# EAGLE design nodo_AS (EAGLE 9.6.2)
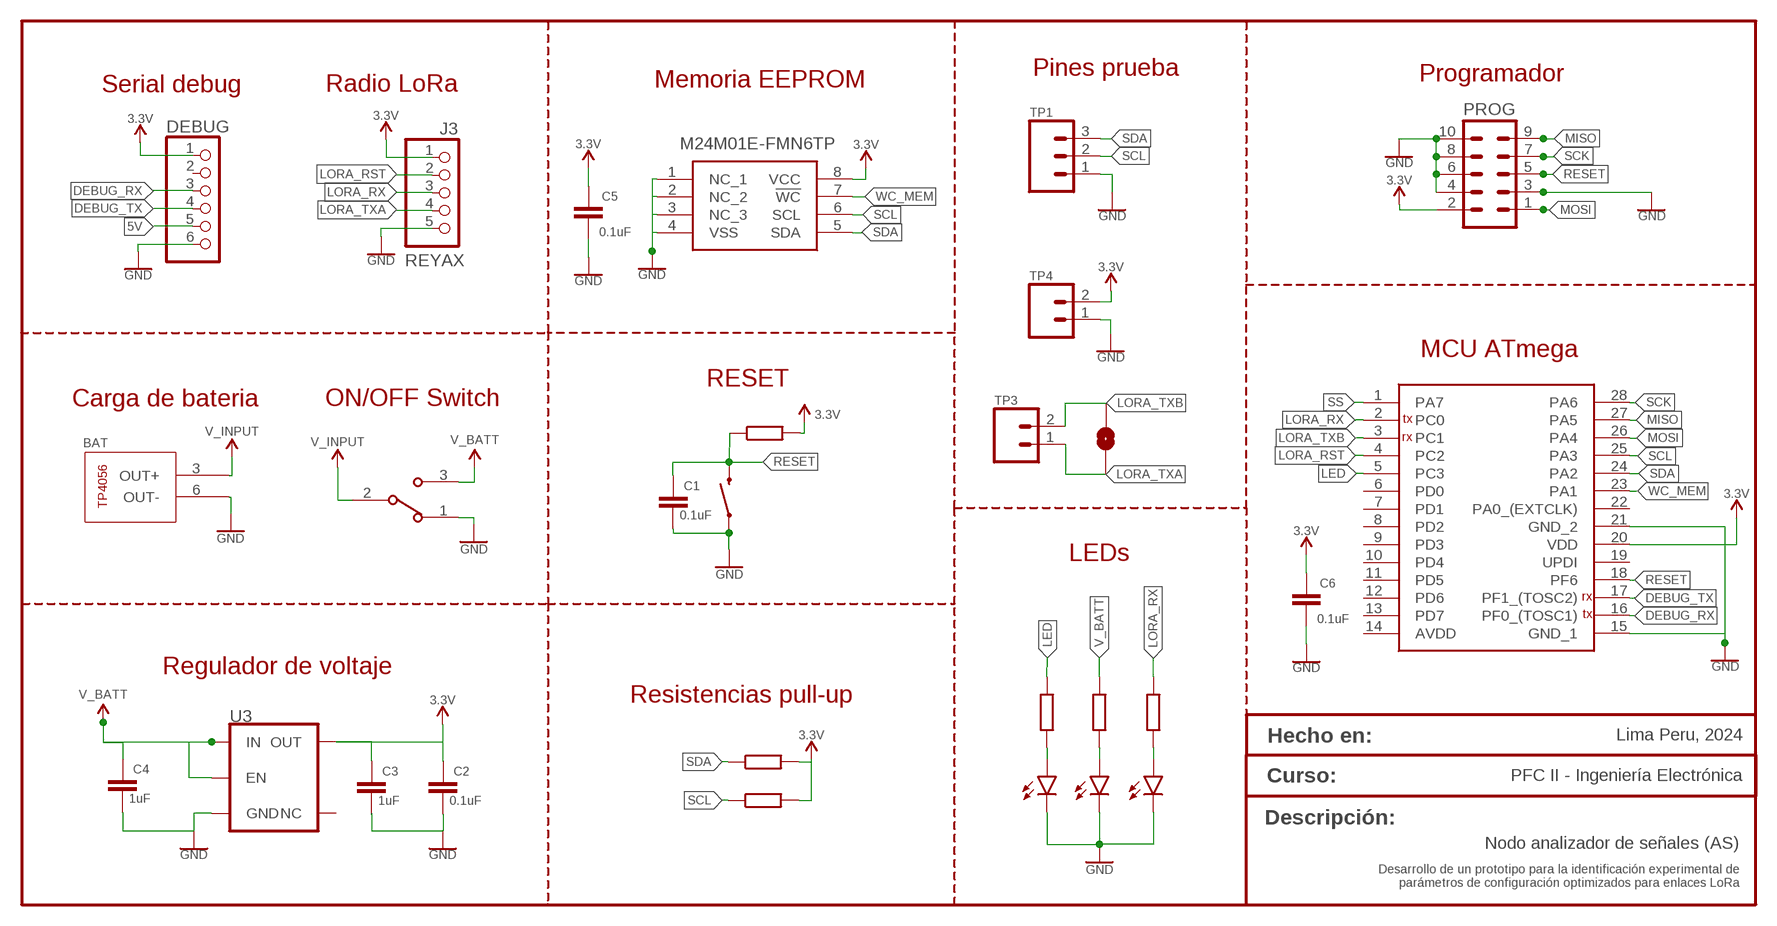
[diagram p0: schematic, sheet 1]

## Parts
BAT  TP4056MODULE  [TP4056MODULE]
C1  0.1uF  C-EUC0603K  [C0603K]
C2  0.1uF  C-EUC0603K  [C0603K]
C3  1uF  C-EUC0603K  [C0603K]
C4  1uF  C-EUC0603K  [C0603K]
C5  0.1uF  0.1UF-0603-25V-(+80/-20%)  [0603]
C6  0.1uF  0.1UF-0603-25V-(+80/-20%)  [0603]
DEBUG  PINHD-1X6  [1X06]
IC1  ATMEGA3208-XU  [SOP65P780X200-28N]
IC2  M24M01E-FMN6TP  [SOIC127P600X175-8N]
J3  REYAX  PINHD-1X5  [1X05]
JP1  JUMPER-SMT_2_NO_NO-SILK_ROUND  [SMT-JUMPER_2_NO_NO-SILK_ROUND]
L_ON  LED_3MM  [LEDRD254W50D405H1055]
L_ON1  LED_3MM  [LEDRD254W50D405H1055]
L_ON2  LED_3MM  [LEDRD254W50D405H1055]
P_RESET  MOMENTARY-SWITCH-SPST-PTH-6.0MM  [TACTILE_SWITCH_PTH_6.0MM]
PROG  ML10-3M  [3M_10]
R1  68  R-EU_0207/10  [0207/10]
R2  68  R-EU_0207/10  [0207/10]
R3  68  R-EU_0207/10  [0207/10]
R4  10k  R-EU_0207/10  [0207/10]
R6  1k  R-EU_0207/10  [0207/10]
R7  1k  R-EU_0207/10  [0207/10]
SW1  EG1213  [SW_EG1213]
TP1  CONN_03  [1X03]
TP3  CONN_02  [1X02]
TP4  CONN_02  [1X02]
U3  3.3V  V_REG_AP2112K-3.3V  [SOT23-5]

## Nets
3.3V: C2.1 C3.1 C5.1 C6.1 DEBUG.1 IC1.20(VDD) IC2.8(VCC) J3.1 PROG.2 R4.2 R6.2 R7.2 TP4.2 U3.5(OUT)
5V: DEBUG.5
DEBUG_RX: DEBUG.3 IC1.16(PF0_(TOSC1))
DEBUG_TX: DEBUG.4 IC1.17(PF1_(TOSC2))
GND: BAT.6(OUT-) C1.2 C2.2 C3.2 C4.2 C5.2 C6.2 DEBUG.6 IC1.15(GND_1) IC1.21(GND_2) IC2.1(NC_1) IC2.2(NC_2) IC2.3(NC_3) IC2.4(VSS) J3.5 L_ON1.C L_ON2.C L_ON.C P_RESET.1 PROG.3 PROG.4 PROG.6 PROG.8 PROG.10 SW1.1 TP1.1 TP4.1 U3.2(GND)
LED: IC1.5(PC3) R3.1
LORA_RST: IC1.4(PC2) J3.2
LORA_RX: IC1.2(PC0) J3.3 R1.1
LORA_TXA: J3.4 JP1.2 TP3.1
LORA_TXB: IC1.3(PC1) JP1.1 TP3.2
MISO: IC1.27(PA5) PROG.9
MOSI: IC1.26(PA4) PROG.1
N$1: L_ON.A R3.2
N$2: L_ON1.A R2.2
N$3: L_ON2.A R1.2
RESET: C1.1 IC1.18(PF6) P_RESET.3 PROG.5 R4.1
SCK: IC1.28(PA6) PROG.7
SCL: IC1.25(PA3) IC2.6(SCL) R7.1 TP1.2
SDA: IC1.24(PA2) IC2.5(SDA) R6.1 TP1.3
SS: IC1.1(PA7)
V_BATT: C4.1 R2.1 SW1.3 U3.1(IN) U3.3(EN)
V_INPUT: BAT.3(OUT+) SW1.2
WC_MEM: IC1.23(PA1) IC2.7(!WC)
Unconnected: DEBUG.2 IC1.6(PD0) IC1.7(PD1) IC1.8(PD2) IC1.9(PD3) IC1.10(PD4) IC1.11(PD5) IC1.12(PD6) IC1.13(PD7) IC1.14(AVDD) IC1.19(UPDI) IC1.22(PA0_(EXTCLK)) U3.4(NC)

## Notes on the sheet
- Pines prueba | Programador
- Serial debug | Radio LoRa | Memoria EEPROM
- MCU ATmega
- RESET
- Carga de bateria | ON/OFF Switch
- tx
- rx
- LEDs
- rx
- tx
- Regulador de voltaje
- Resistencias pull-up
- Hecho en: | Lima Peru, 2024
- Curso: | PFC II - Ingeniería Electrónica
- Descripción:
- Nodo analizador de señales (AS)
- Desarrollo de un prototipo para la identificación experimental de
  parámetros de configuración optimizados para enlaces LoRa

## Library data of the parts
BAT = TP4056MODULE:TP4056MODULE
C1-C4 = rcl:C-EU: CAPACITOR, European symbol; SPICEPREFIX: C
C5 C6 = SparkFun-Capacitors:0.1UF: 0.1µF ceramic capacitors A capacitor is a passive two-terminal electrical component used to store electrical energy temporarily in an electric field.; PROD_ID: CAP-00810
DEBUG = pinhead:PINHD-1X6: PIN HEADER
IC1 = ATMEGA3208-XU:ATMEGA3208-XU: 8-bit Microcontrollers - MCU 20MHz, 32KB, SSOP Source: Datasheet <https://componentsearchengine.com/Datasheets/1/ATMEGA3208-XU.pdf>; DESCRIPTION: 8-bit Microcontrollers - MCU 20MHz, 32KB, SSOP; HEIGHT: 2mm; MANUFACTURER_NAME: Microchip; MANUFACTURER_PART_NUMBER: ATMEGA3208-XU; MOUSER_PART_NUMBER: 556-ATMEGA3208-XU; MOUSER_PRICE-STOCK: https://www.mouser.co.uk/ProductDetail/Microchip-Technology/ATMEGA3208-XU?qs=P1JMDcb91o4lOyDu0%252BDLyg%3D%3D
IC2 = M24M01E-FMN6TP:M24M01E-FMN6TP: 1 Mbit Serial I2C bus EEPROM with configurable device address and software write protection registers Source: Datasheet <https://www.st.com/resource/en/datasheet/m24m01e-f.pdf>; DESCRIPTION: 1 Mbit Serial I2C bus EEPROM with configurable device address and software write protection registers; HEIGHT: 1.75mm; MANUFACTURER_NAME: STMicroelectronics; MANUFACTURER_PART_NUMBER: M24M01E-FMN6TP; MOUSER_PART_NUMBER: 511-M24M01E-FMN6TP; MOUSER_PRICE-STOCK: https://www.mouser.co.uk/ProductDetail/STMicroelectronics/M24M01E-FMN6TP?qs=1Kr7Jg1SGW8I5RljfIUeLw%3D%3D
J3 = pinhead:PINHD-1X5: PIN HEADER
JP1 = SparkFun-Jumpers:JUMPER-SMT_2_NO: Normally open jumper This jumper has two pads in close proximity to each other. Apply solder to close the connection. Round pads are easier to solder for beginners, but are a lot larger. SparkFun Product that uses the round pads: SparkFun EL Sequencer <https://www.sparkfun.com/products/12781>
L_ON L_ON1 L_ON2 = LED_3MM:LED_3MM
P_RESET = SparkFun-Switches:MOMENTARY-SWITCH-SPST: Momentary Switch (Pushbutton) - SPST Normally-open (NO) SPST momentary switches (buttons, pushbuttons). Variants PTH-12MM - 12mm square, through-hole Momentary Pushbutton Switch - 12mm Square <https://www.sparkfun.com/products/9190> (COM-09190) PTH-6.0MM, PTH-6.0MM-KIT - 6.0mm square, through-hole Mini Pushbutton Switch <https://www.sparkfun.com/products/97> (COM-00097) KIT package intended for soldering kit's - only one side of pads' copper is exposed. PTH-RIGHT-ANGLE-KIT - Right-angle, through-hole Right Angle Tactile Button <https://www.sparkfun.com/products/10791> - Used on SparkFun BigTime Watch Kit <https://www.sparkfun.com/products/11734> SMD-12MM - 12mm square, surface-mount Tactile Button - SMD (12mm) <https://www.sparkfun.com/products/12993> (COM-12993) Used on SparkFun PicoBoard <https://www.sparkfun.com/products/11888> SMD-4.5MM - 4.5mm Square Trackball Switch Used on SparkFun Blackberry Trackballer Breakout <https://www.sparkfun.com/products/13169> SMD-4.6MMX2.8MM - 4.60mm x 2.80mm, surface mount Used on SparkFun Pro Micro - RP2040 <https://www.sparkfun.com/products/17717> SMD-5.2MM, SMD-5.2-REDUNDANT - 5.2mm square, surface-mount Mini Pushbutton Switch - SMD <https://www.sparkfun.com/products/8720> (COM-08720) Used on Arduino Pro Mini <https://www.sparkfun.com/products/11114> REDUNDANT package connects both switch circuits together SMD-6.0X3.5MM - 6.0 x 3.5mm, surface mount Momentary Reset Switch SMD <https://www.sparkfun.com/products/8229> (COM-08229) SMD-6.2MM-TALL - 6.2mm square, surface mount Tactile Button - SMD (6mm) <https://www.sparkfun.com/products/12992> Used on SparkFun Digital Sandbox <https://www.sparkfun.com/products/12651> SMD-RIGHT-ANGLE - Right-angle, surface mount Used on SparkFun Block for Intel® Edison - Arduino <https://www.sparkfun.com/products/13036>; PROD_ID: SWCH-08441; SF_SKU: COM-00097
PROG = con-harting-ml:ML10: HARTING; OC_FARNELL: unknown; OC_NEWARK: unknown
R1-R4 R6 R7 = rcl:R-EU_: RESISTOR, European symbol; SPICEPREFIX: R
SW1 = EG1213:EG1213: EG Series SPDT On-On Right Angle Through Hole Slide Switch Check prices <https://pricing.snapeda.com/parts/EG1213/E-Switch/view-part?ref=eda>; AVAILABILITY: In Stock; DESCRIPTION: Slide Switch SPDT Through Hole, Right Angle; MF: E-Switch; MP: EG1213; PACKAGE: None; PRICE: None; PURCHASE-URL: https://pricing.snapeda.com/search/part/EG1213/?ref=eda
TP1 = SparkFun-Connectors:CONN_03: Multi connection point. Often used as Generic Header-pin footprint for 0.1 inch spaced/style header connections On any of the 0.1 inch spaced packages, you can populate with these: Break Away Headers - Straight <https://www.sparkfun.com/products/116> (PRT-00116) Break Away Male Headers - Right Angle <https://www.sparkfun.com/products/553> (PRT-00553) Female Headers <https://www.sparkfun.com/products/115> (PRT-00115) Break Away Headers - Machine Pin <https://www.sparkfun.com/products/117> (PRT-00117) Break Away Female Headers - Swiss Machine Pin <https://www.sparkfun.com/products/743> (PRT-00743) Stackable Header - 3 Pin (Female, 0.1") <https://www.sparkfun.com/products/13875> (PRT-13875) For SCREWTERMINALS and SPRING TERMINALS visit here: Screw Terimnals on SparkFun.com <https://www.sparkfun.com/search/results?term=Screw+Terminals> (5mm/3.5mm/2.54mm spacing) This device is also useful as a general connection point to wire up your design to another part of your project. Our various solder wires solder well into these plated through hole pads. Hook-Up Wire - Assortment (Stranded, 22 AWG) <https://www.sparkfun.com/products/11375> (PRT-11375) Hook-Up Wire - Assortment (Solid Core, 22 AWG) <https://www.sparkfun.com/products/11367> (PRT-11367) View the entire wire category on our website here <https://www.sparkfun.com/categories/141> Special notes: Molex polarized connector foot print use with SKU : PRT-08232 with associated crimp pins and housings.; PROD_ID: XXX-00000; VALUE: 455-1750-1-ND
TP3 TP4 = SparkFun-Connectors:CONN_02: Multi connection point. Often used as Generic Header-pin footprint for 0.1 inch spaced/style header connections On any of the 0.1 inch spaced packages, you can populate with these: Break Away Headers - Straight <https://www.sparkfun.com/products/116> (PRT-00116) Break Away Male Headers - Right Angle <https://www.sparkfun.com/products/553> (PRT-00553) Female Headers <https://www.sparkfun.com/products/115> (PRT-00115) Break Away Headers - Machine Pin <https://www.sparkfun.com/products/117> (PRT-00117) Break Away Female Headers - Swiss Machine Pin <https://www.sparkfun.com/products/743> (PRT-00743) For SCREWTERMINALS and SPRING TERMINALS visit here: Screw Terimnals on SparkFun.com <https://www.sparkfun.com/search/results?term=Screw+Terminals> (5mm/3.5mm/2.54mm spacing) This device is also useful as a general connection point to wire up your design to another part of your project. Our various solder wires solder well into these plated through hole pads. Hook-Up Wire - Assortment (Stranded, 22 AWG) <https://www.sparkfun.com/products/11375> (PRT-11375) Hook-Up Wire - Assortment (Solid Core, 22 AWG) <https://www.sparkfun.com/products/11367> (PRT-11367) View the entire wire category on our website here <https://www.sparkfun.com/categories/141> Special notes: Molex polarized connector foot print use with: PRT-08233 with associated crimp pins and housings. 2.54_SCREWTERM for use with PRT-10571. 3.5mm Screw Terminal footprints for PRT-08084 5mm Screw Terminal footprints for use with PRT-08432
U3 = SparkFun-IC-Power:V_REG_AP2112: AP2112 - 600mA CMOS LDO Regulator w/ Enable The AP2112 is CMOS process low dropout linear regulator with enable function, the regulator delivers a guaranteed 600mA (min.) continuous load current. Features Output Voltage Accuracy: ±1.5% Output Current: 600mA (Min.) Foldback Short Current Protection: 50mA Enable Function to Turn ON/OFF VOUT Low Dropout Voltage (3.3V): 250mV (Typ.) @IOUT=600mA Excellent Load Regulation: 0.2%/A (Typ.) Excellent Line Regulation: 0.02%/V (Typ.) Low Quiescent Current: 55μA (Typ.) Low Standby Current: 0.01μA (Typ.) Low Output Noise: 50μVRMS PSRR: 100Hz -65dB, 1kHz -65dB OTSD Protection Stable with 1.0μF Flexible Cap: Ceramic, Tantalum and Aluminum Electrolytic Operation Temperature Range: -40°C to 85°C ESD: MM 400V, HBM 4000V; PROD_ID: VREG-12457

## Net classes
1 power: width 0.305 mm

## Board
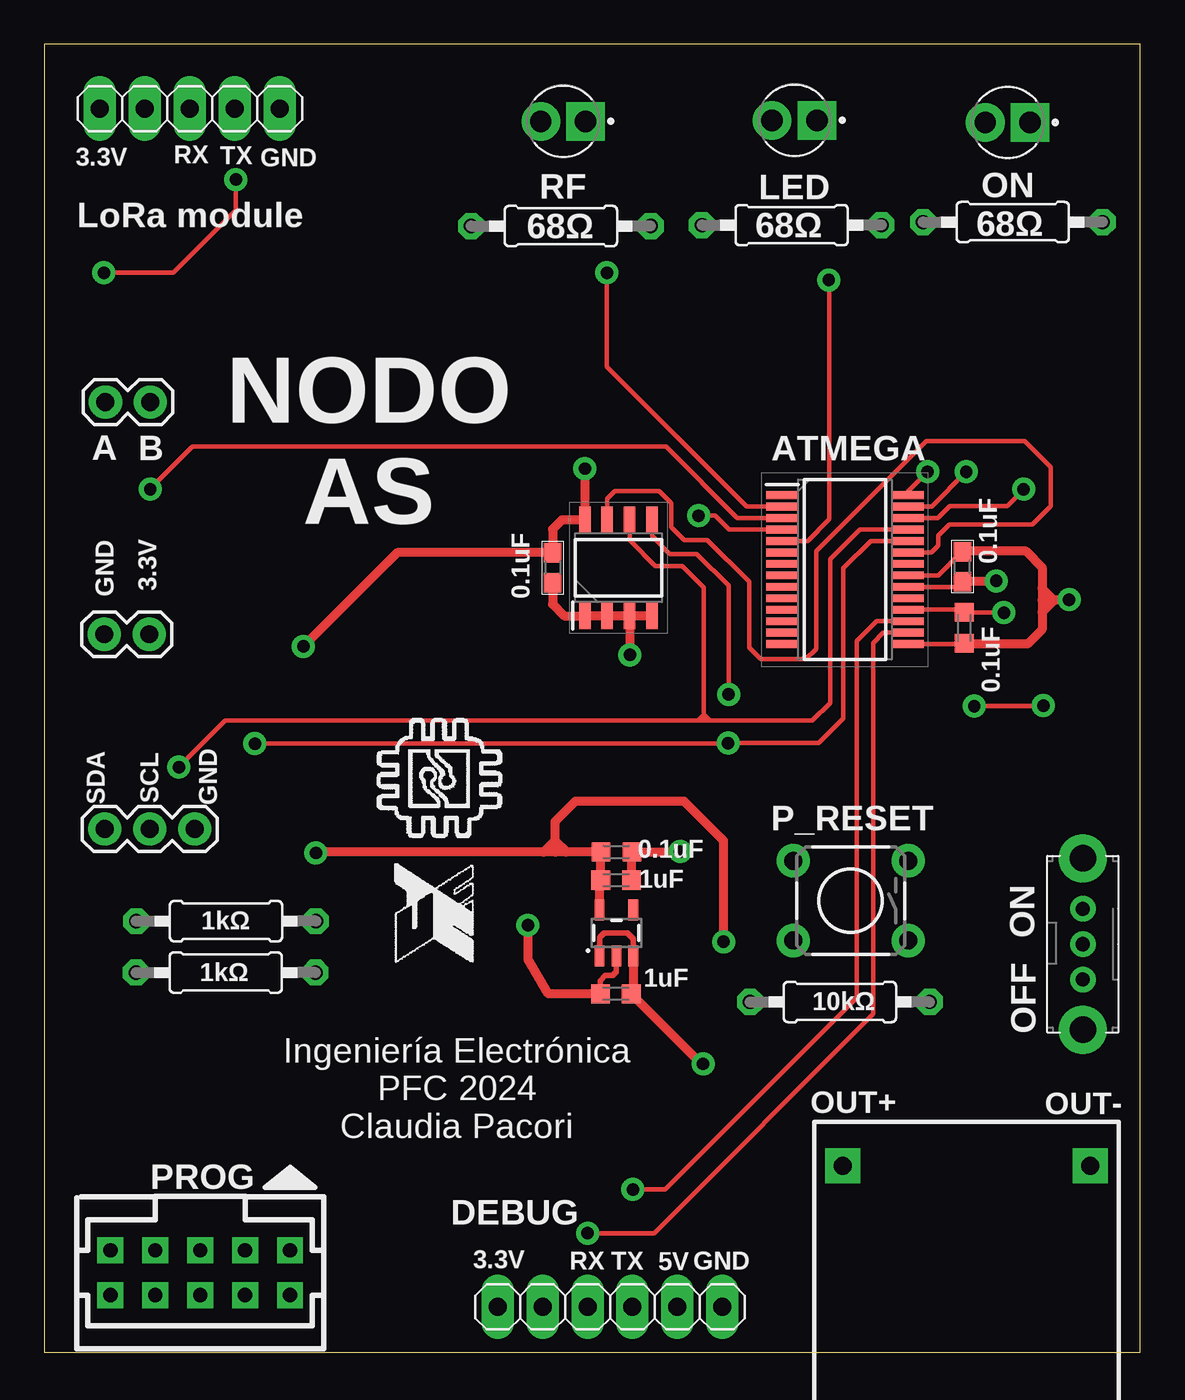
[diagram p1: board, top side]
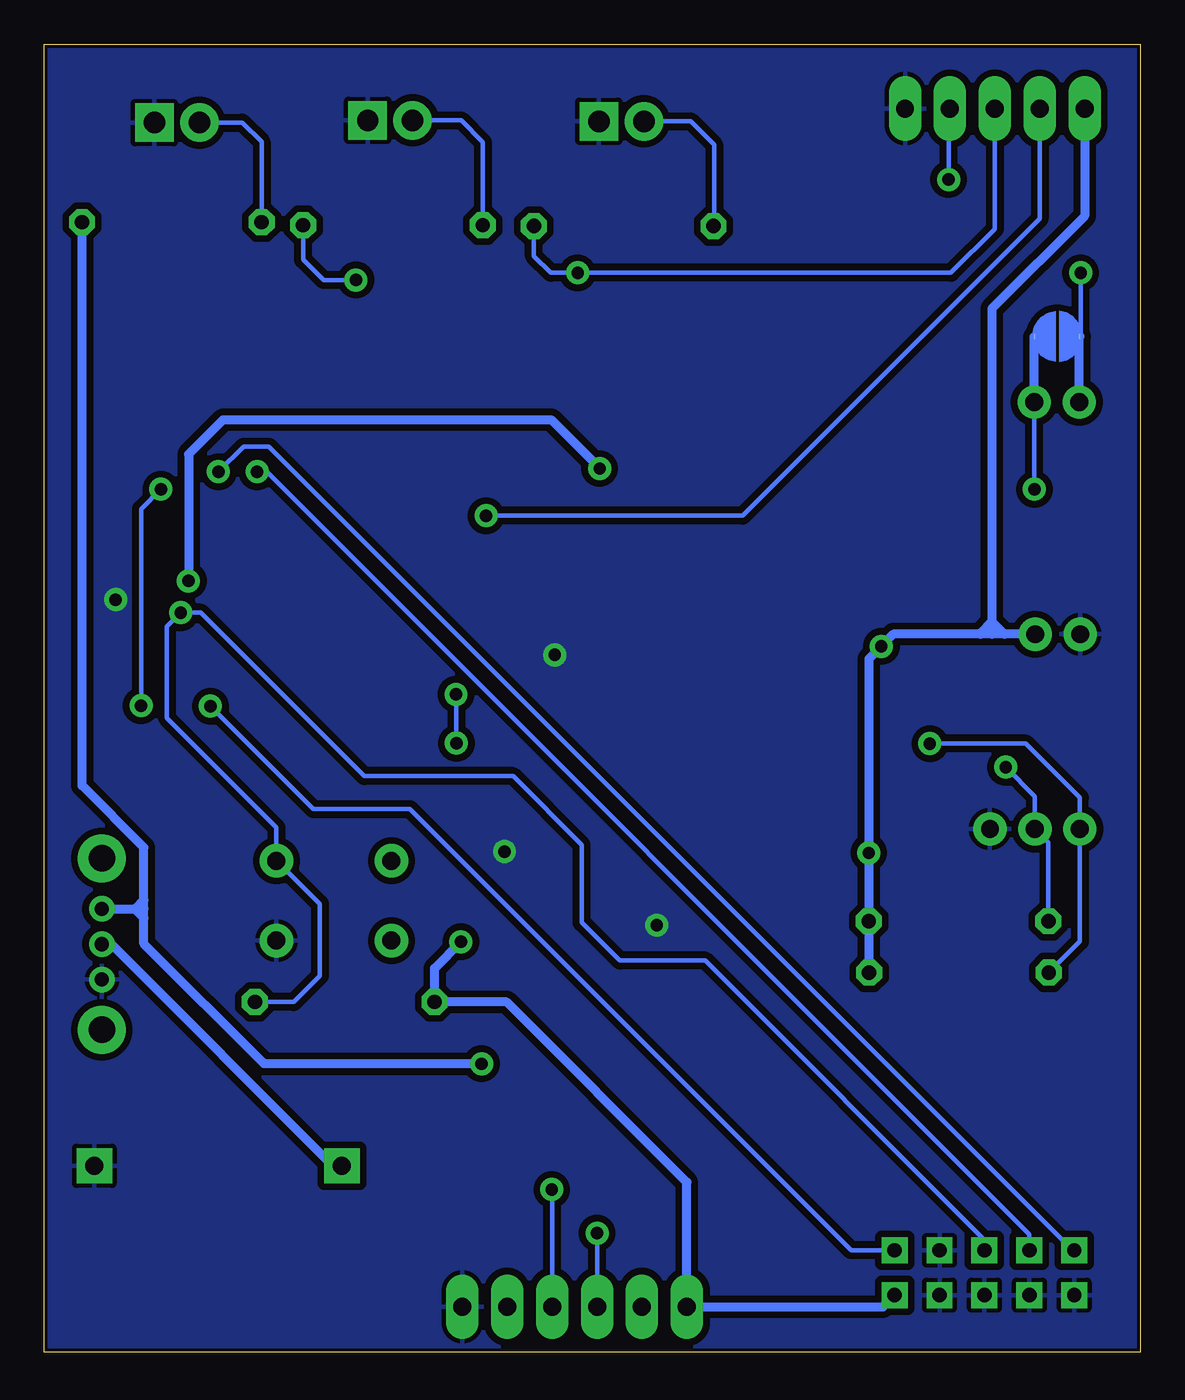
[diagram p2: board, bottom side, seen from below]

Size 62 x 74 mm. Coordinates in mm from the lower left corner, seen from the top.
Outline: 0,0 62,0 62,74 0,74 0,0
Copper layers (1*16): Top 0.035mm / dielectric 1.6mm / Bottom 0.035mm
Design rules "jlcpcb-2layers_my *": minimum track width 5mil, minimum drill 0.2mm, track to track 15mil, track to pad 5mil, pad to pad 5mil, via to via 15mil, smd to smd 5mil, copper to edge 0.2mm, drill to drill 10mil, minimum pad ring 10mil, minimum via ring 3mil, stop-mask expansion 4mil, vias tented up to drill 0.2mm, thermal gap 10mil

### Footprints (pad centres in the part's own frame; a part is rotated, then mirrored left to right if it is on the bottom)
TP4056MODULE = drill 1.016 pad 2 square: 3 25.5,15.6; 6 25.5,1.6
C0603K = smd 1.05 x 1.08: 1 -0.875,0; 2 0.875,0
0603 = smd 1.1 x 1: 1 -0.85,0; 2 0.85,0
1X06 = drill 1.016 long: 1 -6.35,0; 2 -3.81,0; 3 -1.27,0; 4 1.27,0; 5 3.81,0; 6 6.35,0
SOP65P780X200-28N = smd 1.8 x 0.45: 1 -3.55,4.225; 2 -3.55,3.575; 3 -3.55,2.925; 4 -3.55,2.275; 5 -3.55,1.625; 6 -3.55,0.975; 7 -3.55,0.325; 8 -3.55,-0.325; 9 -3.55,-0.975; 10 -3.55,-1.625; 11 -3.55,-2.275; 12 -3.55,-2.925; 13 -3.55,-3.575; 14 -3.55,-4.225; 15 3.55,-4.225; 16 3.55,-3.575; 17 3.55,-2.925; 18 3.55,-2.275; 19 3.55,-1.625; 20 3.55,-0.975; 21 3.55,-0.325; 22 3.55,0.325; 23 3.55,0.975; 24 3.55,1.625; 25 3.55,2.275; 26 3.55,2.925; 27 3.55,3.575; 28 3.55,4.225
SOIC127P600X175-8N = smd 1.525 x 0.65: 1 -2.712,1.905; 2 -2.712,0.635; 3 -2.712,-0.635; 4 -2.712,-1.905; 5 2.712,-1.905; 6 2.712,-0.635; 7 2.712,0.635; 8 2.712,1.905
1X05 = drill 1.016 long: 1 -5.08,0; 2 -2.54,0; 3 0,0; 4 2.54,0; 5 5.08,0
SMT-JUMPER_2_NO_NO-SILK_ROUND = smd 0.152 x 0.305: 1 -1.27,0; 2 1.27,0
LEDRD254W50D405H1055 = drill 1.21: A 1.27,0 | drill 1.21 square: C -1.27,0
TACTILE_SWITCH_PTH_6.0MM = drill 1.016 pad 1.88: 1 -3.251,2.261; 2 3.251,2.261; 3 -3.251,-2.261; 4 3.251,-2.261
3M_10 = drill 0.813 square: 1 -5.08,-1.27; 2 -5.08,1.27; 3 -2.54,-1.27; 4 -2.54,1.27; 5 0,-1.27; 6 0,1.27; 7 2.54,-1.27; 8 2.54,1.27; 9 5.08,-1.27; 10 5.08,1.27
0207/10 = drill 0.813 octagon: 1 -5.08,0; 2 5.08,0
SW_EG1213 = drill 0.8: 1 -2,0; 2 0,0; 3 2,0 | drill 1.5: P$4 -4.85,0; P$5 4.85,0
1X03 = drill 1.016 pad 1.88: 1 0,0; 2 2.54,0; 3 5.08,0
1X02 = drill 1.016 pad 1.88: 1 0,0; 2 2.54,0
SOT23-5 = smd 0.55 x 1.2: 1 -0.95,-1.3; 2 0,-1.3; 3 0.95,-1.3; 4 0.95,1.3; 5 -0.95,1.3

### Placement (x,y rotation side)
BAT  60.76,-14.96 90 top
C1  52.04,40.98 270 top
C2  32.36,28.29 0 top
C3  32.35,26.7 0 top
C4  32.33,20.28 180 top
C5  28.76,44.38 270 top
C6  51.94,44.43 90 top
DEBUG  32,2.56 0 top
IC1  45.28,44.28 0 top
IC2  32.48,44.38 90 top
J3  8.23,70.35 0 top
JP1  4.7,57.47 0 bottom
L_ON  42.43,69.69 180 top
L_ON1  54.49,69.57 180 top
L_ON2  29.36,69.64 180 top
P_RESET  45.62,25.54 180 top
PROG  8.82,4.49 180 top
R1  29.22,63.71 180 top
R2  54.78,63.93 180 top
R3  42.28,63.76 180 top
R4  45,19.81 180 top
R6  10.26,21.47 0 top
R7  10.28,24.38 0 top
SW1  58.74,23.08 90 top
TP1  8.51,29.59 180 top
TP3  3.46,53.75 0 top
TP4  3.4,40.61 0 top
U3  32.36,23.72 0 top

### Tracks (layer width: path | path; a pad name or v marks a point on that pad's centre or on a via)
3.3V  (via drill 0.7 pad 1.3)
  Top 0.254: IC1.20 51.66,43.3 C6.1
  Top 0.508: IC2.8 29.29,47.09 28.76,46.56 C5.1 19.96,45.23 v14.66,39.93 | IC2.8 | U3.5 31.41,26.64 C3.1 31.48,28.28 C2.1 29.51,28.29 | 29.51,28.29 28.91,28.29 | 28.91,28.29 28.24,28.29 | 28.24,28.29 15.41,28.29 v15.36,28.24 | v38.43,23.22 38.43,28.93 36.19,31.17 30.04,31.17 28.88,30 28.88,28.93 | 28.88,28.93 28.88,28.32 28.91,28.29 | 28.88,28.93 28.24,28.29 | 29.51,28.29 28.88,28.93 | C6.1 51.96,43.58 51.99,43.61 53.85,43.61 v53.85,43.64 | v30.58,49.99 IC2.8
  Bottom 0.508: R6.2 15.16,21.47 15.36,21.67 R7.2 v15.36,28.24 15.36,39.22 v14.66,39.93 13.97,40.61 9.04,40.61 | PROG.2 14.56,2.56 DEBUG.1 25.65,9.62 35.85,19.81 R4.2 39.92,21.72 v38.43,23.21 v38.43,23.22 | TP4.2 7.7,40.61 | 7.7,40.61 8.41,40.61 | 8.41,40.61 9.04,40.61 | J3.1 3.15,64.28 8.41,59.03 8.41,41.33 | 8.41,41.33 8.41,40.61 | 7.7,40.61 8.41,41.33 | 8.41,41.33 9.04,40.69 9.04,40.61 | v53.85,43.64 53.85,43.7 53.84,43.71 53.84,50.79 51.88,52.76 33.32,52.76 30.58,50.01 v30.58,49.99
DEBUG_RX  (via drill 0.7 pad 1.3)
  Top 0.254: v30.73,6.73 34.5,6.73 46.89,19.12 46.89,40.13 47.46,40.7 IC1.16
  Bottom 0.254: DEBUG.3 v30.73,6.73
DEBUG_TX  (via drill 0.7 pad 1.3)
  Top 0.254: v33.29,9.2 35.13,9.2 45.96,20.03 45.96,40.22 47.09,41.35 IC1.17
  Bottom 0.254: DEBUG.4 33.27,9.17 v33.29,9.2
GND  (via drill 0.7 pad 1.3)
  Top 0.254: IC1.15 51.98,40.05 52.01,40.08 C1.2 | IC1.21 50.55,43.95 51.89,45.28 C6.2
  Top 0.305: U3.2 32.36,21.51 32.15,21.3 31.74,21.3 31.45,21.02 C4.2
  Top 0.508: C5.2 28.76,42.31 29.41,41.66 30.56,41.66 IC2.1 IC2.2 IC2.3 | IC2.3 IC2.4 | C3.2 33.23,28.28 C2.2 35.94,28.3 v35.97,28.32 | C4.2 28.52,20.28 27.36,22.25 v27.36,24.16 | C6.2 51.96,45.31 55.53,45.31 56.44,44.4 56.44,43.21 | 56.44,43.21 56.44,42.54 | 56.44,42.54 56.44,41.86 | 56.44,41.86 56.44,40.89 55.62,40.08 52.01,40.08 | IC2.3 33.11,39.45 v33.12,39.45 | 56.44,42.54 57.1,42.54 | 57.07,42.57 v57.96,42.57 | 56.44,43.21 57.07,42.57 | 57.07,42.57 57.1,42.54 | 57.1,42.54 57.1,42.52 56.44,41.86
  pour Bottom: -2.21,75.49 -2.21,-1.4 62.92,-1.4 62.92,75.49
LED  (via drill 0.7 pad 1.3)
  Top 0.254: v44.37,60.65 44.4,60.63 44.4,47.12 43.18,45.9 IC1.5
  Bottom 0.254: v44.37,60.65 46.2,60.65 47.35,61.81 R3.1
LORA_RST  (via drill 0.7 pad 1.3)
  Top 0.254: IC1.4 41.71,46.52 38.75,46.52 37.96,47.32 v37.01,47.32
  Bottom 0.254: J3.2 5.69,64.12 22.5,47.32 v37.01,47.32
LORA_RX  (via drill 0.7 pad 1.3)
  Top 0.254: IC1.2 39.74,47.85 31.83,55.77 v31.83,61.06
  Bottom 0.254: J3.3 8.23,63.55 10.72,61.06 v31.83,61.06 33.35,61.06 34.3,62.01 R1.1
LORA_TXA  (via drill 0.7 pad 1.3)
  Top 0.254: v3.38,61.06 7.29,61.06 10.85,64.62 v10.85,66.34
  Bottom 0.254: JP1.2 3.38,57.52 v3.38,61.06 | v10.85,66.34 10.85,70.28 J3.4
  Bottom 0.508: TP3.1 3.46,57.43 JP1.2
LORA_TXB  (via drill 0.7 pad 1.3)
  Top 0.254: IC1.3 39.21,47.2 35.18,51.23 8.38,51.23 5.99,48.84 v5.99,48.82
  Bottom 0.254: v5.99,48.82 5.99,53.74 TP3.2
  Bottom 0.508: TP3.2 6,57.43 JP1.1
MISO  (via drill 0.7 pad 1.3)
  Top 0.254: IC1.27 50.19,47.85 v52.15,49.81
  Bottom 0.254: PROG.9 3.82,5.76 49.29,51.23 50.72,51.23 v52.15,49.81
MOSI  (via drill 0.7 pad 1.3)
  Top 0.254: IC1.26 50.53,47.2 51.21,47.88 54.46,47.88 v55.4,48.82 | v52.6,36.55 56.49,36.55 v56.51,36.58
  Bottom 0.254: PROG.1 16.36,5.76 41.32,30.72 46.77,30.72 v52.6,36.55 | v56.51,36.58 56.51,47.7 v55.4,48.82
N$1
  Bottom 0.254: L_ON.A 38.43,69.69 37.19,68.45 37.19,63.77 R3.2
N$2
  Bottom 0.254: L_ON1.A 50.8,69.57 49.7,68.47 R2.2
N$3
  Bottom 0.254: L_ON2.A 25.44,69.64 24.1,68.3 24.1,63.75 R1.2
RESET  (via drill 0.7 pad 1.3)
  Top 0.254: IC1.18 51.89,42 C1.1 52.06,41.83 v54.28,41.83
  Bottom 0.254: R4.1 47.89,19.81 46.41,21.29 46.41,25.36 48.85,27.8 P_RESET.3 48.87,29.68 55.07,35.88 55.07,41.05 v54.28,41.83 53.14,41.83 43.89,32.59 35.48,32.59 31.6,28.7 31.6,24.31 29.44,22.15 24.63,22.15 8.82,6.35 PROG.5
SCK  (via drill 0.7 pad 1.3)
  Top 0.254: IC1.28 48.83,48.68 v49.96,49.81
  Bottom 0.254: PROG.7 6.28,6.67 49.42,49.81 v49.96,49.81
SCL  (via drill 0.7 pad 1.3)
  Top 0.254: IC1.25 46.12,46.55 44.45,44.88 44.45,36.73 43.44,35.73 37.64,35.73 | v7.62,33.1 10.25,35.73 37,35.73 | 37.64,35.73 37.31,35.73 | 37.31,35.73 37,35.73 | IC2.6 33.11,45.93 34.57,44.48 36.09,44.48 37.31,43.26 37.31,36.04 | 37.31,35.73 37.31,36.04 | 37.31,36.04 37,35.73 | 37.31,36.04 37.33,36.04 37.64,35.73
  Bottom 0.254: R7.1 5.2,28.83 TP1.2 5.97,31.45 v7.62,33.1
SDA  (via drill 0.7 pad 1.3)
  Top 0.254: IC1.24 46.74,45.9 45.19,44.35 45.19,35.84 43.8,34.46 v38.68,34.46 38.65,34.43 v11.91,34.43 | IC2.5 34.38,46.16 35.38,45.16 36.91,45.16 38.71,43.36 v38.71,37.21
  Bottom 0.254: R6.1 3.43,23.23 TP1.3 3.43,31.37 6.48,34.43 v11.91,34.43 | v38.71,37.21 38.68,37.19 v38.68,34.46
V_BATT  (via drill 0.7 pad 1.3)
  Top 0.305: U3.1 31.41,23.47 31.67,23.72 32.98,23.72 33.32,23.38 33.32,22.43 U3.3
  Top 0.508: v37.26,16.31 37.17,16.31 C4.1 33.31,20.38 U3.3
  Bottom 0.508: R2.1 59.86,32.05 56.36,28.54 56.36,25.57 | v37.26,16.31 49.56,16.31 56.36,23.1 56.36,24.56 | 56.36,24.56 56.36,25.08 | 56.36,25.08 56.36,25.57 | SW1.3 56.88,25.08 | 56.85,25.08 56.36,25.08 | 56.36,25.57 56.85,25.08 | 56.85,25.08 56.88,25.08 | 56.88,25.08 56.36,24.56
V_INPUT
  Bottom 0.508: SW1.2 58.22,23.08 45.67,10.54 BAT.3
WC_MEM
  Top 0.254: IC1.23 50.18,45.25 50.57,45.64 50.57,46.2 51.18,46.81 55.88,46.81 56.92,47.85 56.92,50.06 55.45,51.54 49.89,51.54 43.67,45.32 43.67,39.79 43.08,39.2 40.54,39.2 39.88,39.86 39.88,43.59 37.51,45.96 36.19,45.96 35.46,46.69 35.46,48.03 34.77,48.72 32.26,48.72 31.84,48.3 IC2.7

### Text on the board
tPlace: NODO / AS | Ingeniería Electrónica / PFC 2024 / Claudia Pacori
tNames: 3.3V | RX | TX | GND | RF | LED | ON | LoRa module | 68Ω | 68Ω | 68Ω | A | B | ATMEGA | 0.1uF | GND | 3.3V | 0.1uF | 0.1uF | SDA | SCL | GND | 0.1uF | 1uF | ON | 1kΩ | 1kΩ | 1uF | 10kΩ | OFF | OUT+ | OUT- | PROG | DEBUG | 3.3V | RX | TX | 5V | GND